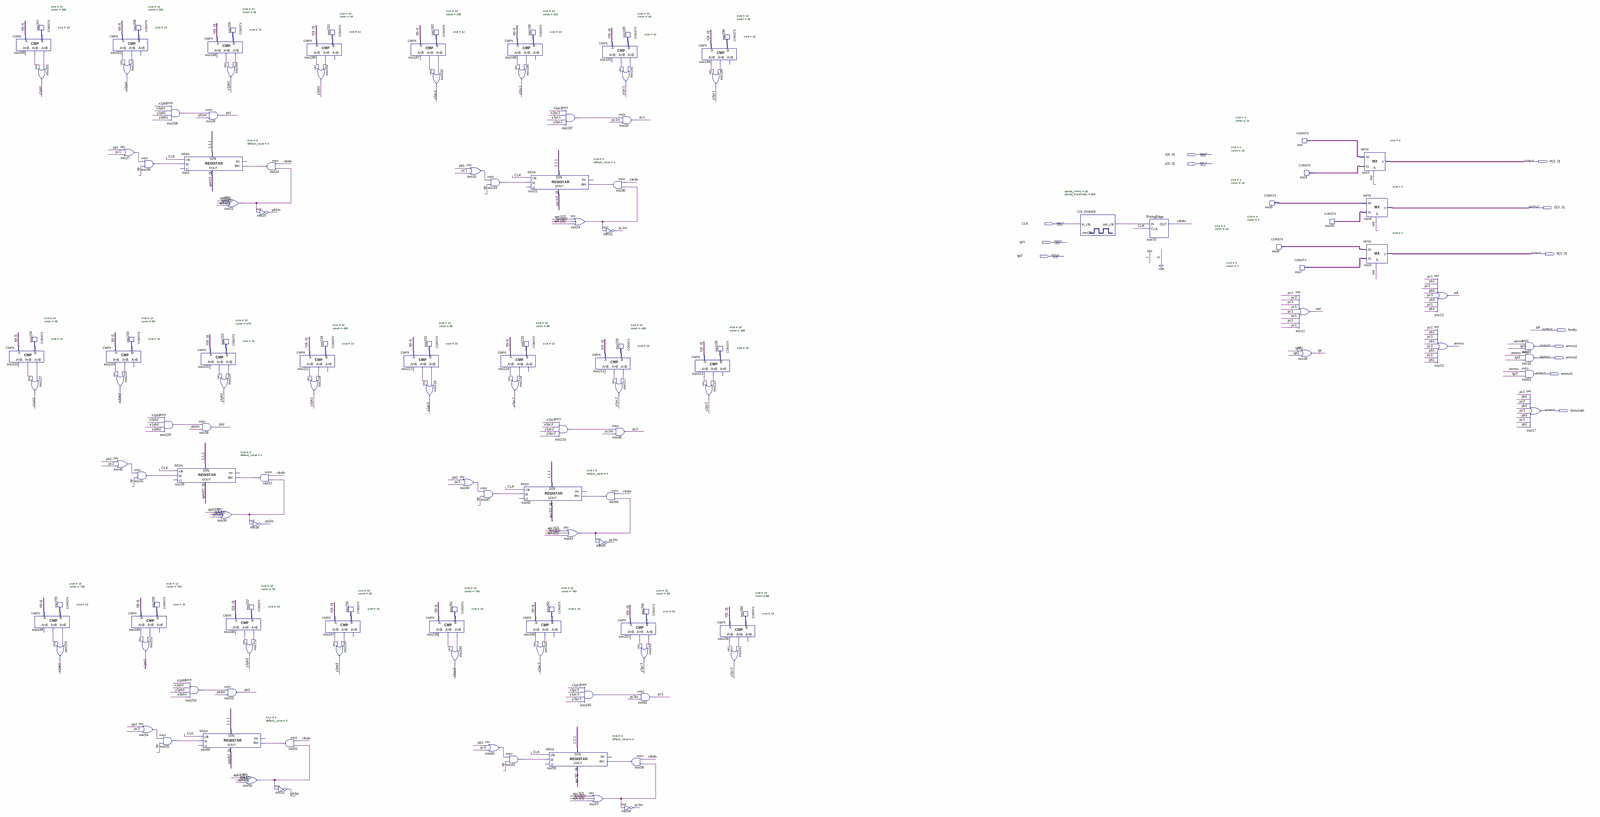
[diagram p0: schematic sheet, whole]
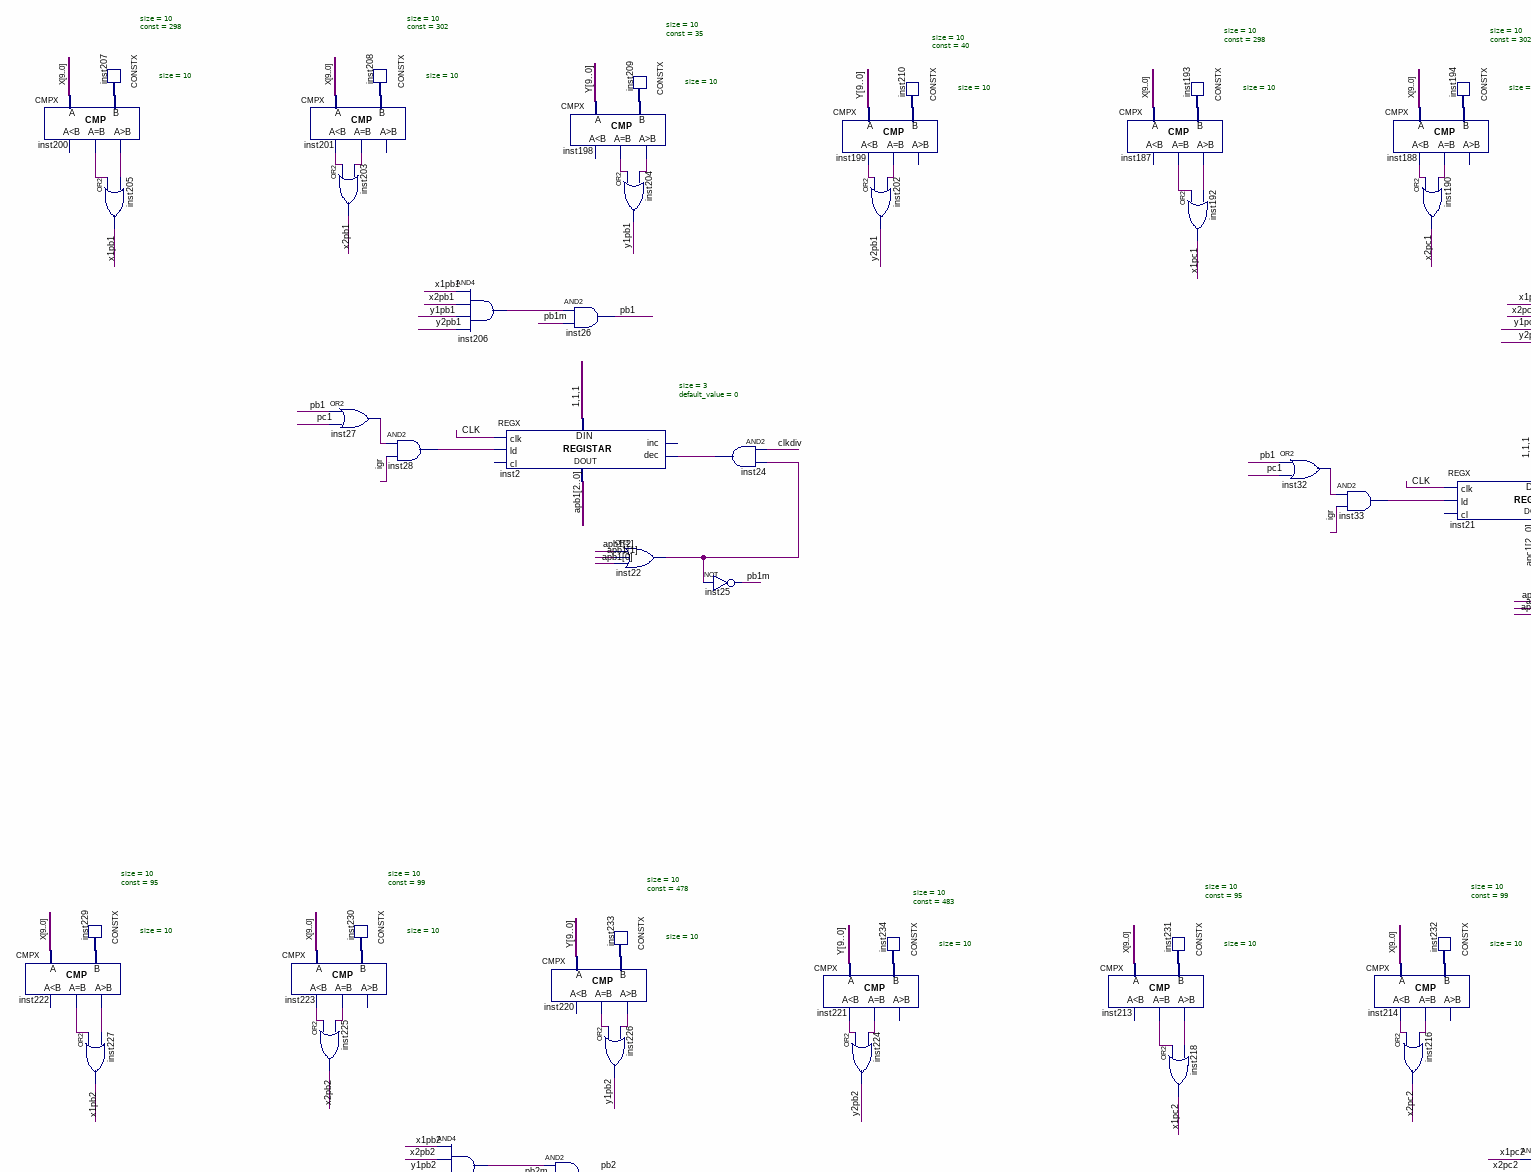
[diagram p1: schematic sheet, upper left part]
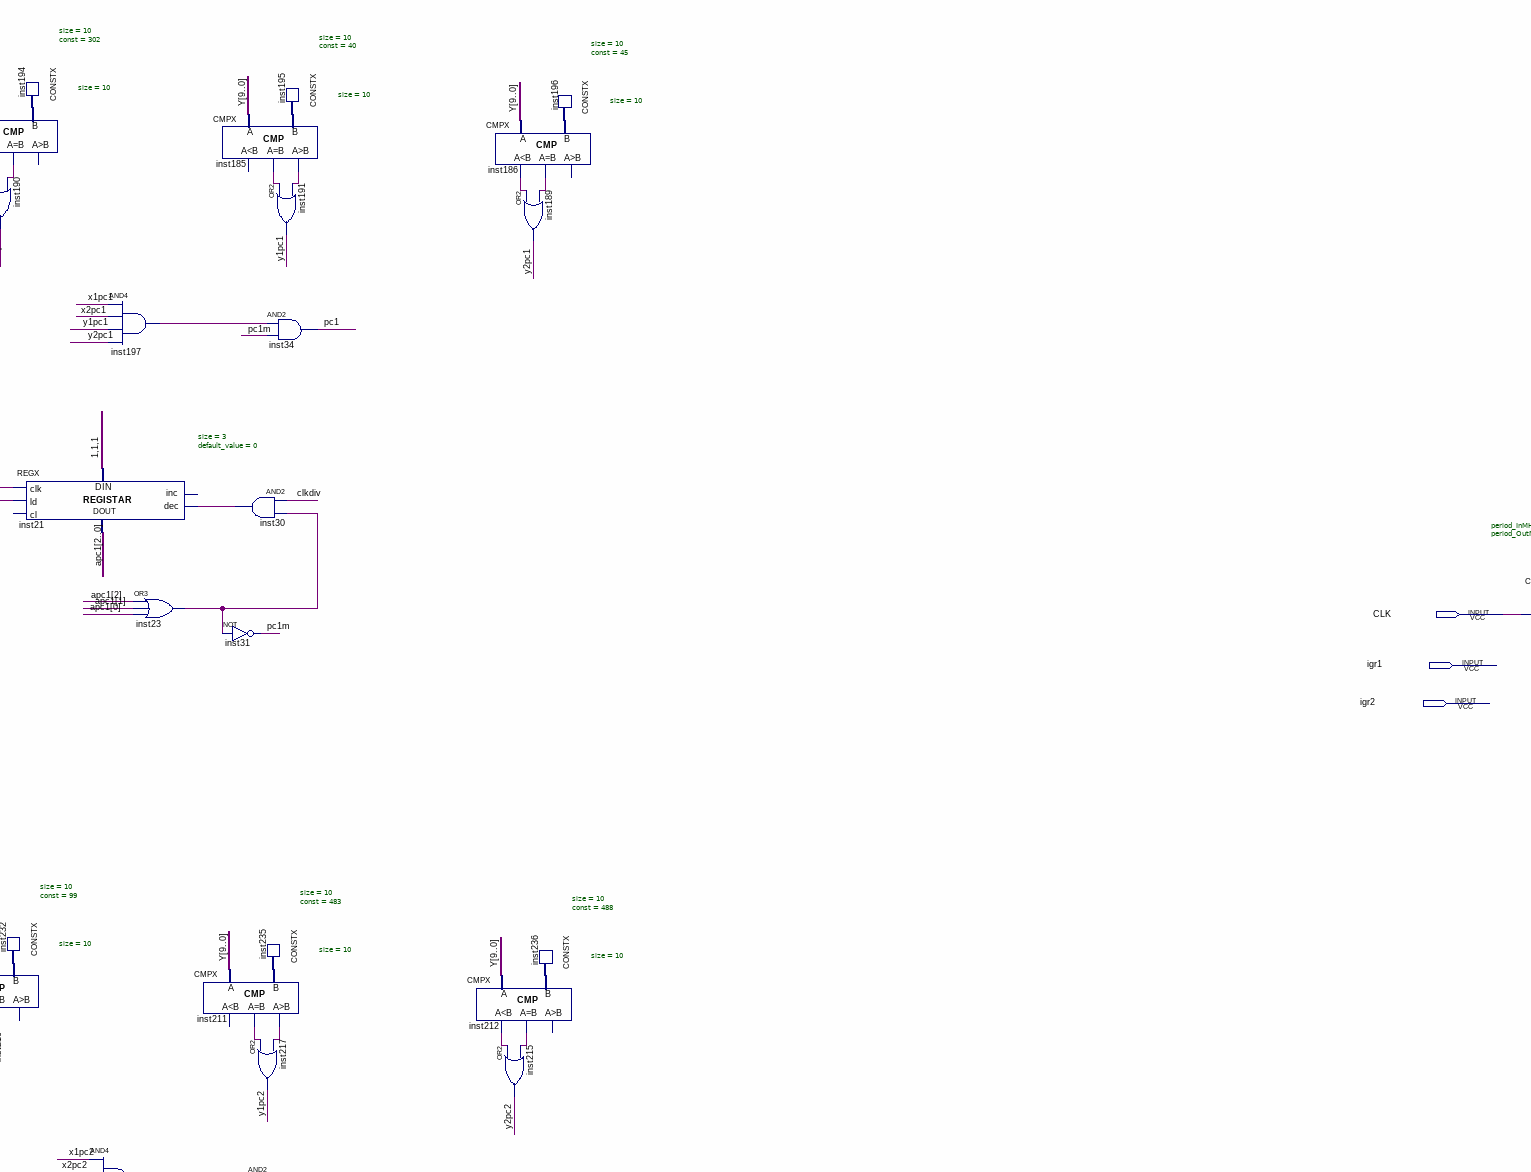
[diagram p2: schematic sheet, upper centre part]
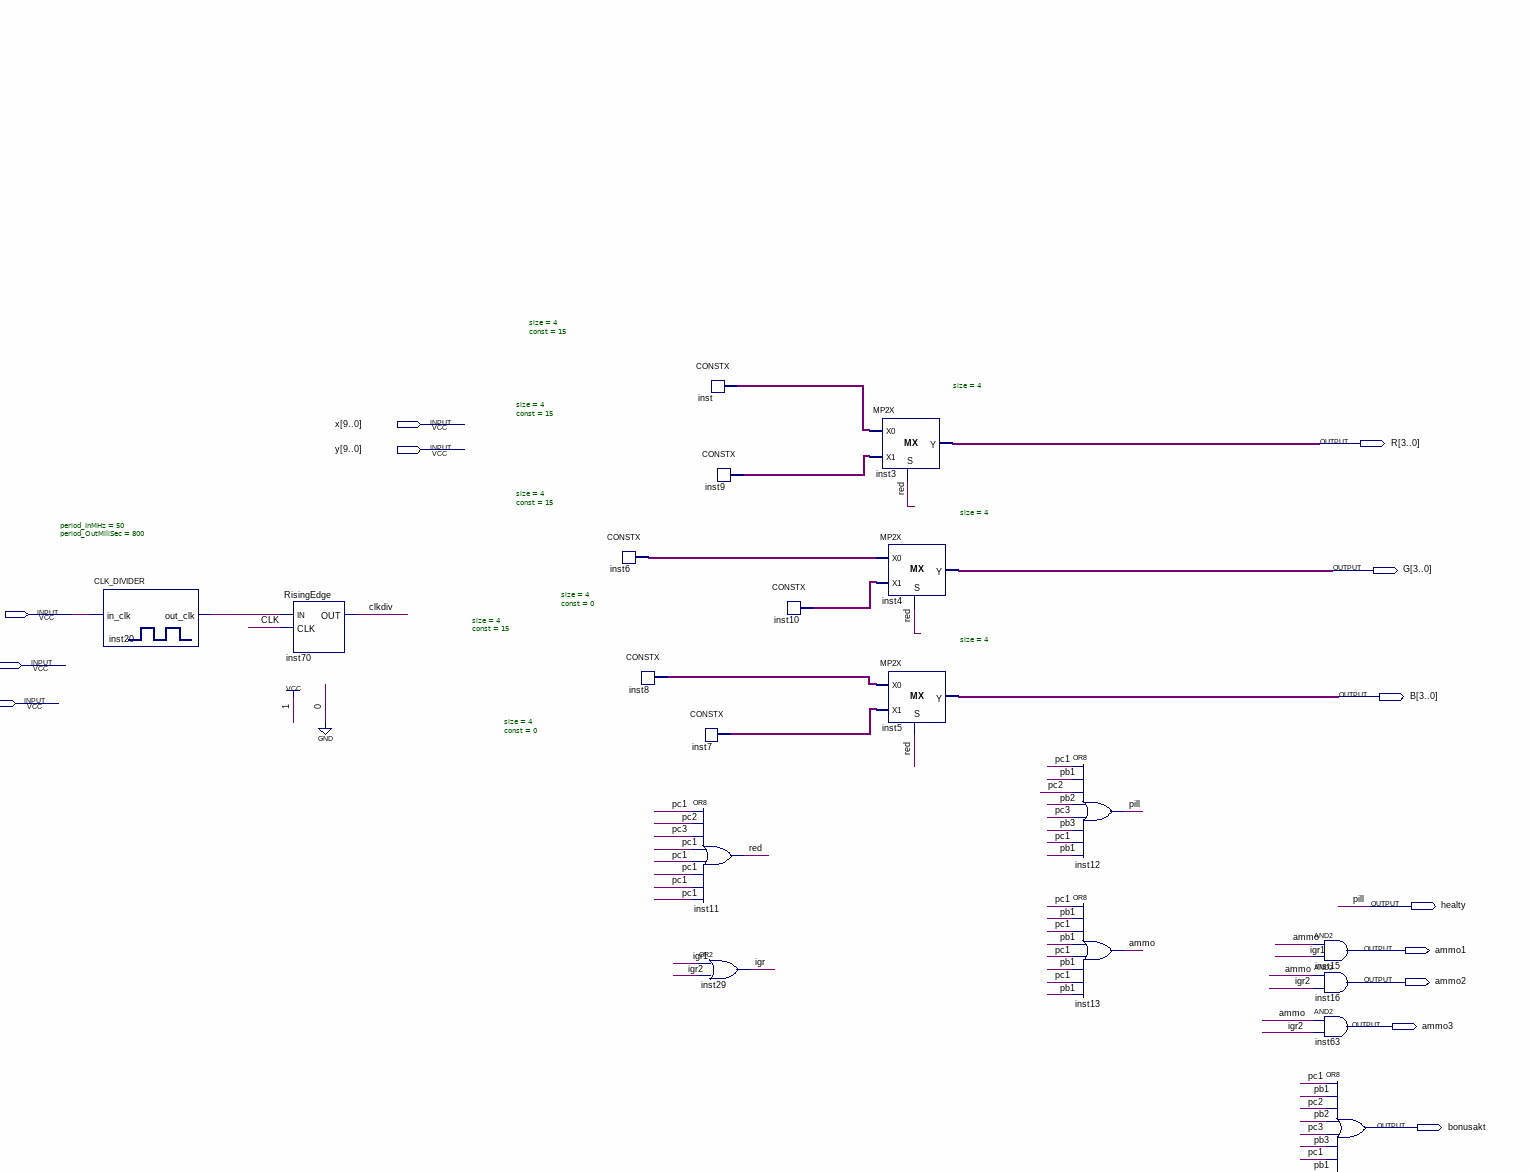
[diagram p3: schematic sheet, upper right part]
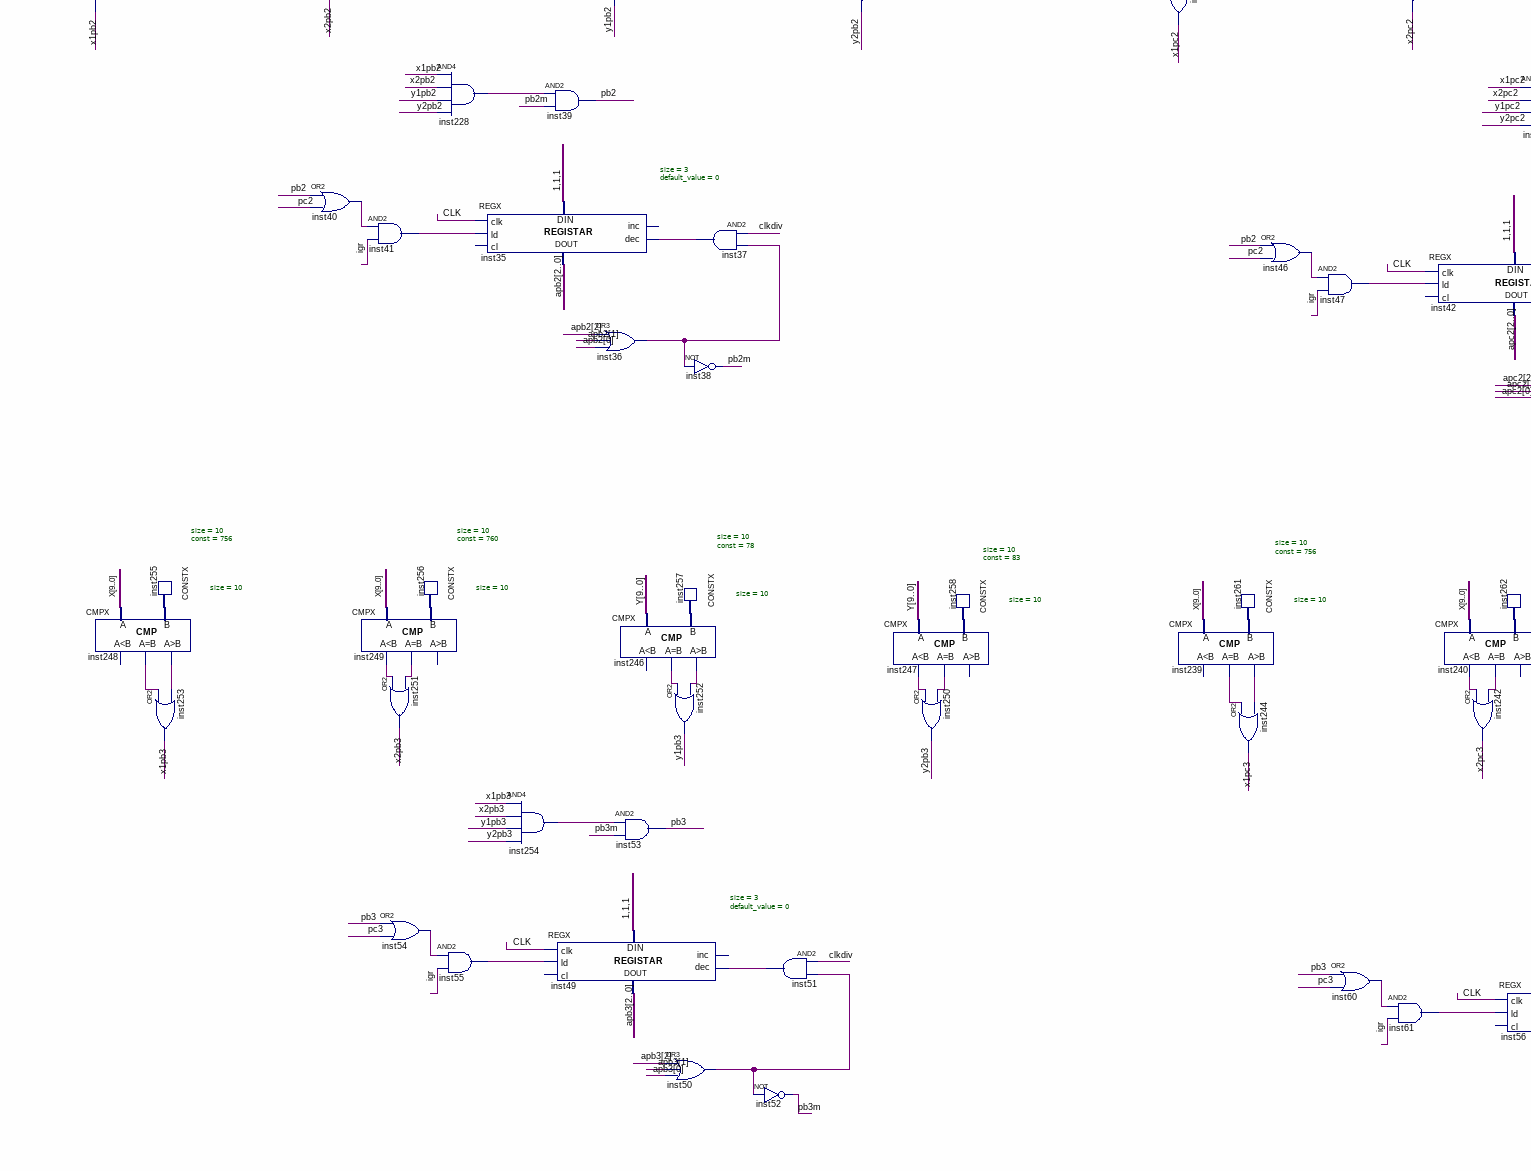
[diagram p4: schematic sheet, lower left part]
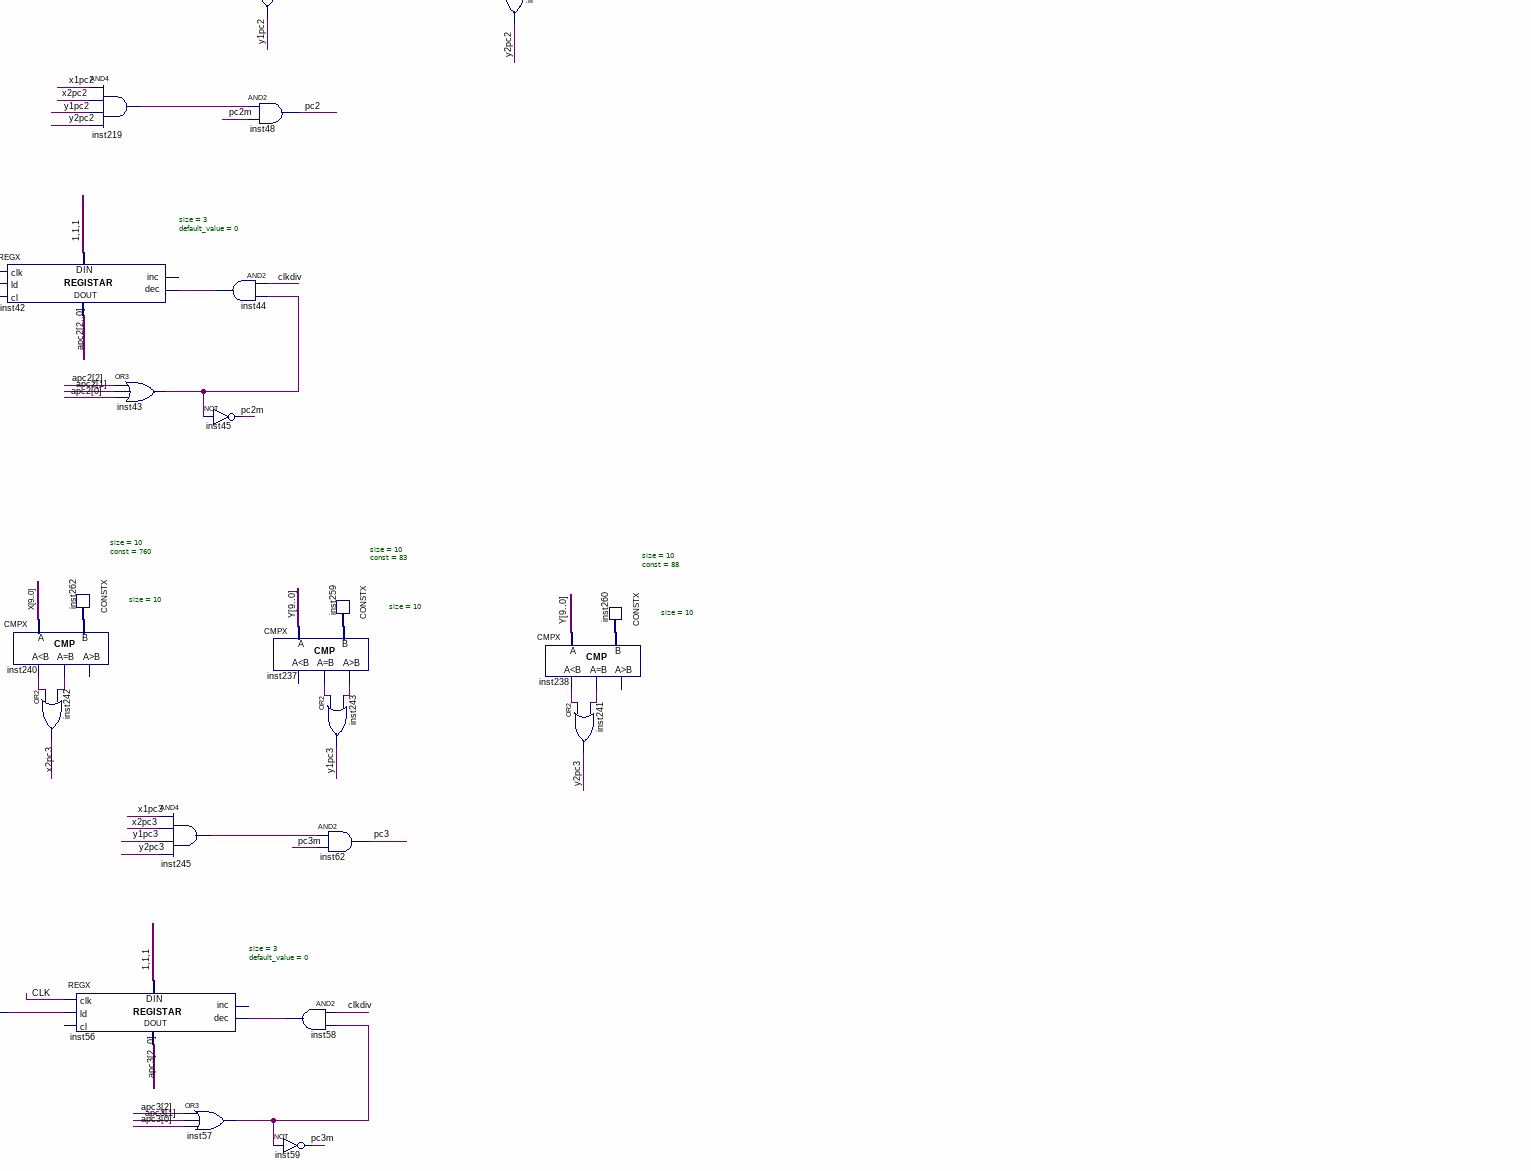
[diagram p5: schematic sheet, lower centre part]
// Quartus schematic LayerBonus.bdf as structural Verilog: 139 symbols, 13 pins
module LayerBonus (
  input  [9:0] x,
  input  [9:0] y,
  input  CLK,
  input  igr1,
  input  igr2,
  output [3:0] R,
  output [3:0] G,
  output [3:0] B,
  output healty,
  output ammo1,
  output ammo2,
  output ammo3,
  output bonusakt
);

  wire ammo, clkdiv, igr, inst20_out_clk, inst22_out, inst23_out, inst24_out, inst27_out, inst28_out,
       inst30_out, inst32_out, inst33_out, inst36_out, inst37_out, inst40_out, inst41_out, inst43_out,
       inst44_out, inst46_out, inst47_out, inst50_out, inst51_out, inst54_out, inst55_out, inst57_out,
       inst58_out, inst60_out, inst61_out, inst185_eq, inst185_gr, inst186_eq, inst186_ls, inst187_eq,
       inst187_gr, inst188_eq, inst188_ls, inst197_out, inst198_eq, inst198_gr, inst199_eq, inst199_ls,
       inst200_eq, inst200_gr, inst201_eq, inst201_ls, inst206_out, inst211_eq, inst211_gr, inst212_eq,
       inst212_ls, inst213_eq, inst213_gr, inst214_eq, inst214_ls, inst219_out, inst220_eq, inst220_gr,
       inst221_eq, inst221_ls, inst222_eq, inst222_gr, inst223_eq, inst223_ls, inst228_out, inst237_eq,
       inst237_gr, inst238_eq, inst238_ls, inst239_eq, inst239_gr, inst240_eq, inst240_ls, inst245_out,
       inst246_eq, inst246_gr, inst247_eq, inst247_ls, inst248_eq, inst248_gr, inst249_eq, inst249_ls,
       inst254_out, pb1, pb1m, pb2, pb2m, pb3, pb3m, pc1, pc1m, pc2, pc2m, pc3, pc3m, red, x1pb1, x1pb2,
       x1pb3, x1pc1, x1pc2, x1pc3, x2pb1, x2pb2, x2pb3, x2pc1, x2pc2, x2pc3, y1pb1, y1pb2, y1pb3, y1pc1,
       y1pc2, y1pc3, y2pb1, y2pb2, y2pb3, y2pc1, y2pc2, y2pc3;
  wire [2:0] apb1, apb2, apb3, apc1, apc2, apc3;
  wire [3:0] inst6_data, inst7_data, inst8_data, inst9_data, inst10_data, inst_data;
  wire [9:0] inst193_data, inst194_data, inst195_data, inst196_data, inst207_data, inst208_data,
       inst209_data, inst210_data, inst229_data, inst230_data, inst231_data, inst232_data, inst233_data,
       inst234_data, inst235_data, inst236_data, inst255_data, inst256_data, inst257_data, inst258_data,
       inst259_data, inst260_data, inst261_data, inst262_data;

  CMPX #(.size(10)) inst200 (.A(x), .B(inst207_data), .eq(inst200_eq), .gr(inst200_gr));  // open: ls
  CMPX #(.size(10)) inst222 (.A(x), .B(inst229_data), .eq(inst222_eq), .gr(inst222_gr));  // open: ls
  CONSTX #(.size(10), .\const (298)) inst207 (.data(inst207_data));
  or inst205 (x1pb1, inst200_eq, inst200_gr);
  CONSTX #(.size(10), .\const (95)) inst229 (.data(inst229_data));
  or inst227 (x1pb2, inst222_eq, inst222_gr);
  CMPX #(.size(10)) inst248 (.A(x), .B(inst255_data), .eq(inst248_eq), .gr(inst248_gr));  // open: ls
  CONSTX #(.size(10), .\const (756)) inst255 (.data(inst255_data));
  or inst253 (x1pb3, inst248_eq, inst248_gr);
  CMPX #(.size(10)) inst201 (.A(x), .B(inst208_data), .ls(inst201_ls), .eq(inst201_eq));  // open: gr
  CMPX #(.size(10)) inst223 (.A(x), .B(inst230_data), .ls(inst223_ls), .eq(inst223_eq));  // open: gr
  or inst203 (x2pb1, inst201_ls, inst201_eq);
  or inst27 (inst27_out, pb1, pc1);
  CONSTX #(.size(10), .\const (99)) inst230 (.data(inst230_data));
  or inst225 (x2pb2, inst223_ls, inst223_eq);
  or inst40 (inst40_out, pb2, pc2);
  CMPX #(.size(10)) inst249 (.A(x), .B(inst256_data), .ls(inst249_ls), .eq(inst249_eq));  // open: gr
  CONSTX #(.size(10), .\const (302)) inst208 (.data(inst208_data));
  and inst28 (inst28_out, inst27_out, igr);
  and inst41 (inst41_out, inst40_out, igr);
  or inst251 (x2pb3, inst249_ls, inst249_eq);
  or inst54 (inst54_out, pb3, pc3);
  and inst228 (inst228_out, x1pb2, x2pb2, y1pb2, y2pb2);
  CONSTX #(.size(10), .\const (760)) inst256 (.data(inst256_data));
  and inst55 (inst55_out, inst54_out, igr);
  and inst206 (inst206_out, x1pb1, x2pb1, y1pb1, y2pb1);
  REGX #(.size(3), .default_value(0)) inst2 (
    .clk(CLK), .ld(inst28_out), .dec(inst24_out), .data_in(3'b111), .data_out(apb1));  // open: cl, inc
  REGX #(.size(3), .default_value(0)) inst35 (
    .clk(CLK), .ld(inst41_out), .dec(inst37_out), .data_in(3'b111), .data_out(apb2));  // open: cl, inc
  CMPX #(.size(10)) inst220 (.A(y), .B(inst233_data), .eq(inst220_eq), .gr(inst220_gr));  // open: ls
  and inst39 (pb2, inst228_out, pb2m);
  and inst254 (inst254_out, x1pb3, x2pb3, y1pb3, y2pb3);
  REGX #(.size(3), .default_value(0)) inst49 (
    .clk(CLK), .ld(inst55_out), .dec(inst51_out), .data_in(3'b111), .data_out(apb3));  // open: cl, inc
  CMPX #(.size(10)) inst198 (.A(y), .B(inst209_data), .eq(inst198_eq), .gr(inst198_gr));  // open: ls
  and inst26 (pb1, inst206_out, pb1m);
  CONSTX #(.size(10), .\const (478)) inst233 (.data(inst233_data));
  or inst226 (y1pb2, inst220_eq, inst220_gr);
  or inst36 (inst36_out, apb2[2], apb2[1], apb2[0]);
  CONSTX #(.size(10), .\const (35)) inst209 (.data(inst209_data));
  or inst204 (y1pb1, inst198_eq, inst198_gr);
  or inst22 (inst22_out, apb1[2], apb1[1], apb1[0]);
  CMPX #(.size(10)) inst246 (.A(y), .B(inst257_data), .eq(inst246_eq), .gr(inst246_gr));  // open: ls
  and inst53 (pb3, inst254_out, pb3m);
  not inst25 (pb1m, inst22_out);
  and inst37 (inst37_out, clkdiv, inst36_out);
  not inst38 (pb2m, inst36_out);
  CONSTX #(.size(10), .\const (78)) inst257 (.data(inst257_data));
  or inst252 (y1pb3, inst246_eq, inst246_gr);
  or inst50 (inst50_out, apb3[2], apb3[1], apb3[0]);
  and inst24 (inst24_out, clkdiv, inst22_out);
  not inst52 (pb3m, inst50_out);
  and inst51 (inst51_out, clkdiv, inst50_out);
  CMPX #(.size(10)) inst199 (.A(y), .B(inst210_data), .ls(inst199_ls), .eq(inst199_eq));  // open: gr
  CMPX #(.size(10)) inst221 (.A(y), .B(inst234_data), .ls(inst221_ls), .eq(inst221_eq));  // open: gr
  or inst224 (y2pb2, inst221_ls, inst221_eq);
  CONSTX #(.size(10), .\const (40)) inst210 (.data(inst210_data));
  or inst202 (y2pb1, inst199_ls, inst199_eq);
  CONSTX #(.size(10), .\const (483)) inst234 (.data(inst234_data));
  CMPX #(.size(10)) inst247 (.A(y), .B(inst258_data), .ls(inst247_ls), .eq(inst247_eq));  // open: gr
  CONSTX #(.size(10), .\const (83)) inst258 (.data(inst258_data));
  or inst250 (y2pb3, inst247_ls, inst247_eq);
  CMPX #(.size(10)) inst213 (.A(x), .B(inst231_data), .eq(inst213_eq), .gr(inst213_gr));  // open: ls
  CMPX #(.size(10)) inst187 (.A(x), .B(inst193_data), .eq(inst187_eq), .gr(inst187_gr));  // open: ls
  CONSTX #(.size(10), .\const (95)) inst231 (.data(inst231_data));
  or inst218 (x1pc2, inst213_eq, inst213_gr);
  CONSTX #(.size(10), .\const (298)) inst193 (.data(inst193_data));
  or inst192 (x1pc1, inst187_eq, inst187_gr);
  CMPX #(.size(10)) inst239 (.A(x), .B(inst261_data), .eq(inst239_eq), .gr(inst239_gr));  // open: ls
  or inst46 (inst46_out, pb2, pc2);
  CONSTX #(.size(10), .\const (756)) inst261 (.data(inst261_data));
  or inst244 (x1pc3, inst239_eq, inst239_gr);
  or inst32 (inst32_out, pb1, pc1);
  and inst33 (inst33_out, inst32_out, igr);
  CMPX #(.size(10)) inst214 (.A(x), .B(inst232_data), .ls(inst214_ls), .eq(inst214_eq));  // open: gr
  and inst47 (inst47_out, inst46_out, igr);
  or inst60 (inst60_out, pb3, pc3);
  CMPX #(.size(10)) inst188 (.A(x), .B(inst194_data), .ls(inst188_ls), .eq(inst188_eq));  // open: gr
  or inst190 (x2pc1, inst188_ls, inst188_eq);
  or inst216 (x2pc2, inst214_ls, inst214_eq);
  and inst61 (inst61_out, inst60_out, igr);
  CONSTX #(.size(10), .\const (302)) inst194 (.data(inst194_data));
  REGX #(.size(3), .default_value(0)) inst21 (
    .clk(CLK), .ld(inst33_out), .dec(inst30_out), .data_in(3'b111), .data_out(apc1));  // open: cl, inc
  CONSTX #(.size(10), .\const (99)) inst232 (.data(inst232_data));
  REGX #(.size(3), .default_value(0)) inst42 (
    .clk(CLK), .ld(inst47_out), .dec(inst44_out), .data_in(3'b111), .data_out(apc2));  // open: cl, inc
  CMPX #(.size(10)) inst240 (.A(x), .B(inst262_data), .ls(inst240_ls), .eq(inst240_eq));  // open: gr
  or inst242 (x2pc3, inst240_ls, inst240_eq);
  CONSTX #(.size(10), .\const (760)) inst262 (.data(inst262_data));
  REGX #(.size(3), .default_value(0)) inst56 (
    .clk(CLK), .ld(inst61_out), .dec(inst58_out), .data_in(3'b111), .data_out(apc3));  // open: cl, inc
  and inst197 (inst197_out, x1pc1, x2pc1, y1pc1, y2pc1);
  or inst23 (inst23_out, apc1[2], apc1[1], apc1[0]);
  and inst219 (inst219_out, x1pc2, x2pc2, y1pc2, y2pc2);
  or inst43 (inst43_out, apc2[2], apc2[1], apc2[0]);
  and inst245 (inst245_out, x1pc3, x2pc3, y1pc3, y2pc3);
  or inst57 (inst57_out, apc3[2], apc3[1], apc3[0]);
  CMPX #(.size(10)) inst185 (.A(y), .B(inst195_data), .eq(inst185_eq), .gr(inst185_gr));  // open: ls
  and inst30 (inst30_out, clkdiv, inst23_out);
  not inst31 (pc1m, inst23_out);
  CMPX #(.size(10)) inst211 (.A(y), .B(inst235_data), .eq(inst211_eq), .gr(inst211_gr));  // open: ls
  and inst44 (inst44_out, clkdiv, inst43_out);
  not inst45 (pc2m, inst43_out);
  CONSTX #(.size(10), .\const (40)) inst195 (.data(inst195_data));
  or inst191 (y1pc1, inst185_eq, inst185_gr);
  and inst34 (pc1, inst197_out, pc1m);
  CONSTX #(.size(10), .\const (483)) inst235 (.data(inst235_data));
  or inst217 (y1pc2, inst211_eq, inst211_gr);
  and inst48 (pc2, inst219_out, pc2m);
  CMPX #(.size(10)) inst237 (.A(y), .B(inst259_data), .eq(inst237_eq), .gr(inst237_gr));  // open: ls
  and inst58 (inst58_out, clkdiv, inst57_out);
  not inst59 (pc3m, inst57_out);
  CONSTX #(.size(10), .\const (83)) inst259 (.data(inst259_data));
  or inst243 (y1pc3, inst237_eq, inst237_gr);
  and inst62 (pc3, inst245_out, pc3m);
  CMPX #(.size(10)) inst186 (.A(y), .B(inst196_data), .ls(inst186_ls), .eq(inst186_eq));  // open: gr
  CMPX #(.size(10)) inst212 (.A(y), .B(inst236_data), .ls(inst212_ls), .eq(inst212_eq));  // open: gr
  or inst189 (y2pc1, inst186_ls, inst186_eq);
  CONSTX #(.size(10), .\const (488)) inst236 (.data(inst236_data));
  or inst215 (y2pc2, inst212_ls, inst212_eq);
  CMPX #(.size(10)) inst238 (.A(y), .B(inst260_data), .ls(inst238_ls), .eq(inst238_eq));  // open: gr
  CONSTX #(.size(10), .\const (45)) inst196 (.data(inst196_data));
  or inst241 (y2pc3, inst238_ls, inst238_eq);
  CONSTX #(.size(10), .\const (88)) inst260 (.data(inst260_data));
  CLK_DIVIDER #(.period_InMHz(50), .period_OutMiliSec(800)) inst20 (.in_clk(CLK), .out_clk(inst20_out_clk));
  RisingEdge inst70 (.IN(inst20_out_clk), .CLK(CLK), .OUT(clkdiv));
  CONSTX #(.size(4), .\const (15)) inst6 (.data(inst6_data));
  CONSTX #(.size(4), .\const (15)) inst8 (.data(inst8_data));
  CONSTX #(.size(4), .\const (15)) inst (.data(inst_data));
  CONSTX #(.size(4), .\const (15)) inst9 (.data(inst9_data));
  CONSTX #(.size(4), .\const (0)) inst7 (.data(inst7_data));
  or inst11 (red, pc1, pc2, pc3, pc1, pc1, pc1, pc1, pc1);
  or inst29 (igr, igr1, igr2);
  CONSTX #(.size(4), .\const (0)) inst10 (.data(inst10_data));
  MP2X #(.size(4)) inst3 (.S(red), .X0(inst_data), .X1(inst9_data), .Y(R));
  MP2X #(.size(4)) inst4 (.S(red), .X0(inst6_data), .X1(inst10_data), .Y(G));
  MP2X #(.size(4)) inst5 (.S(red), .X0(inst8_data), .X1(inst7_data), .Y(B));
  or inst12 (healty, pc1, pb1, pc2, pb2, pc3, pb3, pc1, pb1);
  or inst13 (ammo, pc1, pb1, pc1, pb1, pc1, pb1, pc1, pb1);
  and inst15 (ammo1, ammo, igr1);
  and inst16 (ammo2, ammo, igr2);
  and inst63 (ammo3, ammo, igr2);
  or inst17 (bonusakt, pc1, pb1, pc2, pb2, pc3, pb3, pc1, pb1);

  // Other names for the same wires on the sheet: pill = healty
endmodule
